# EasyEDA Pro project MAX5864_REUSE.eprj, board PCB1
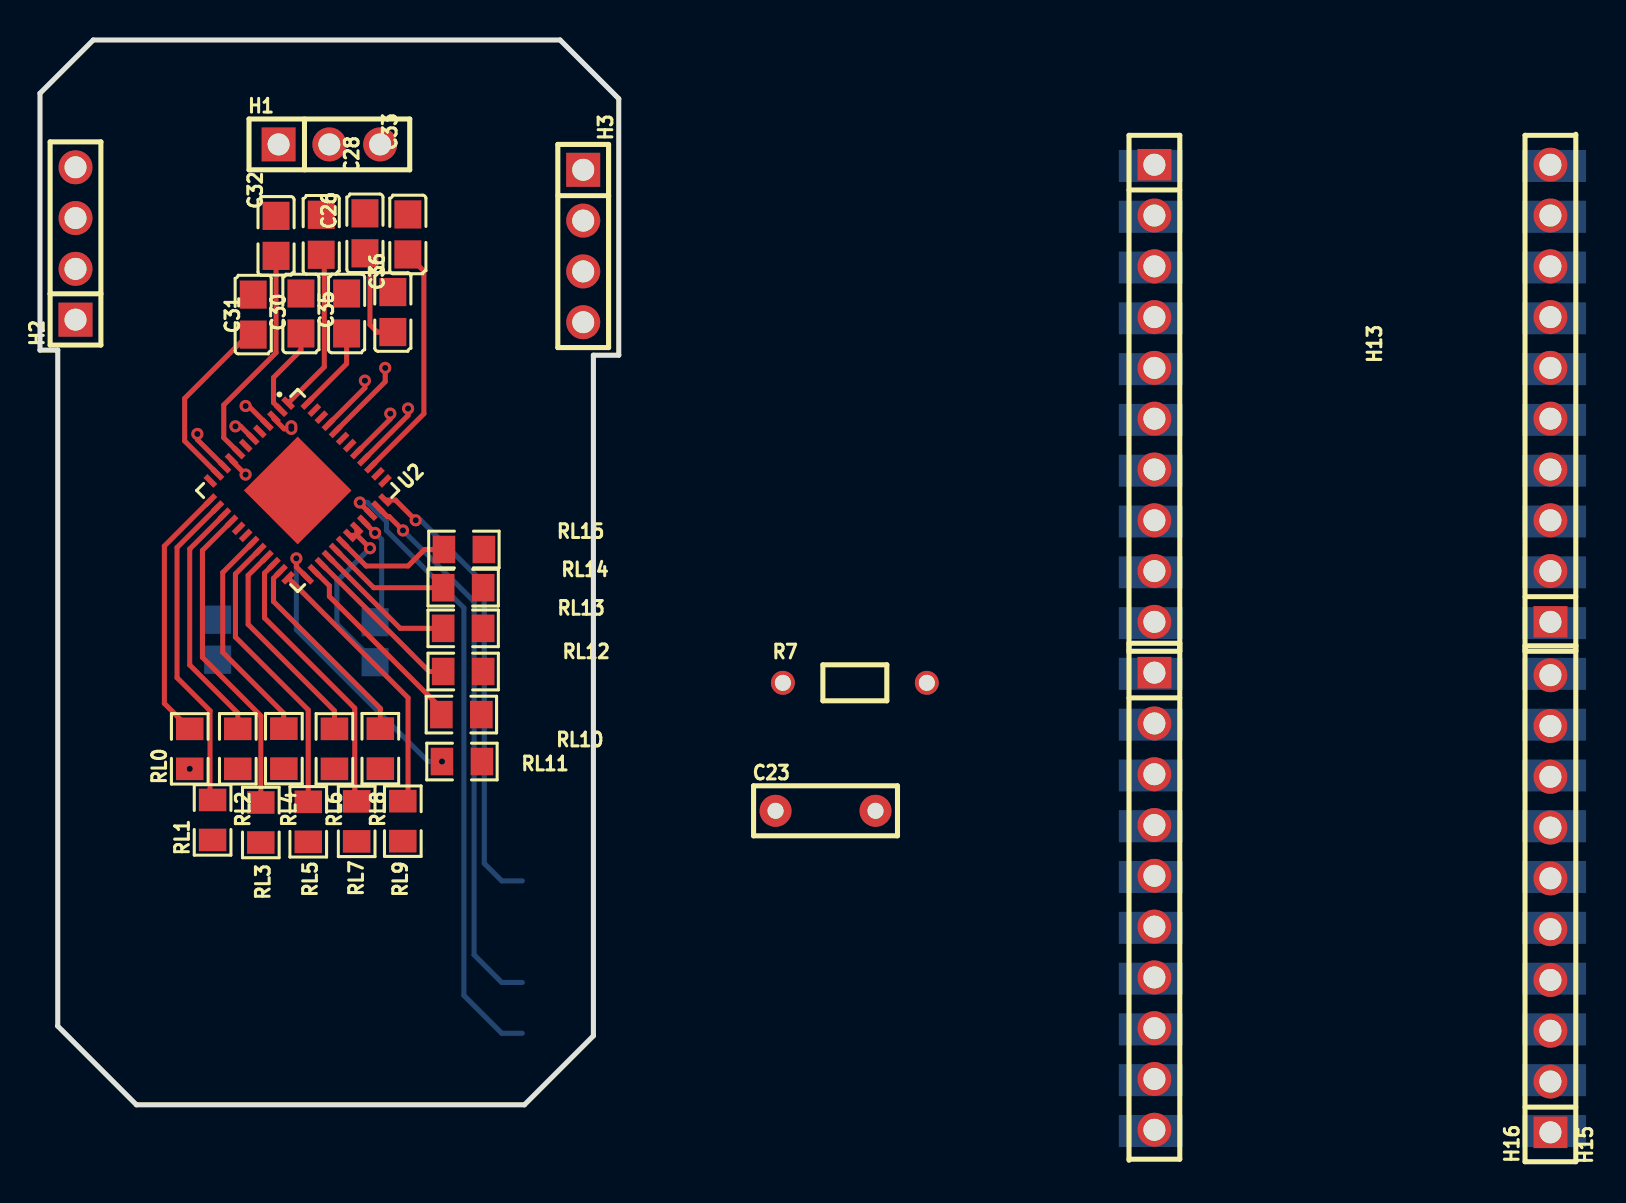
[diagram p4: board, top side]
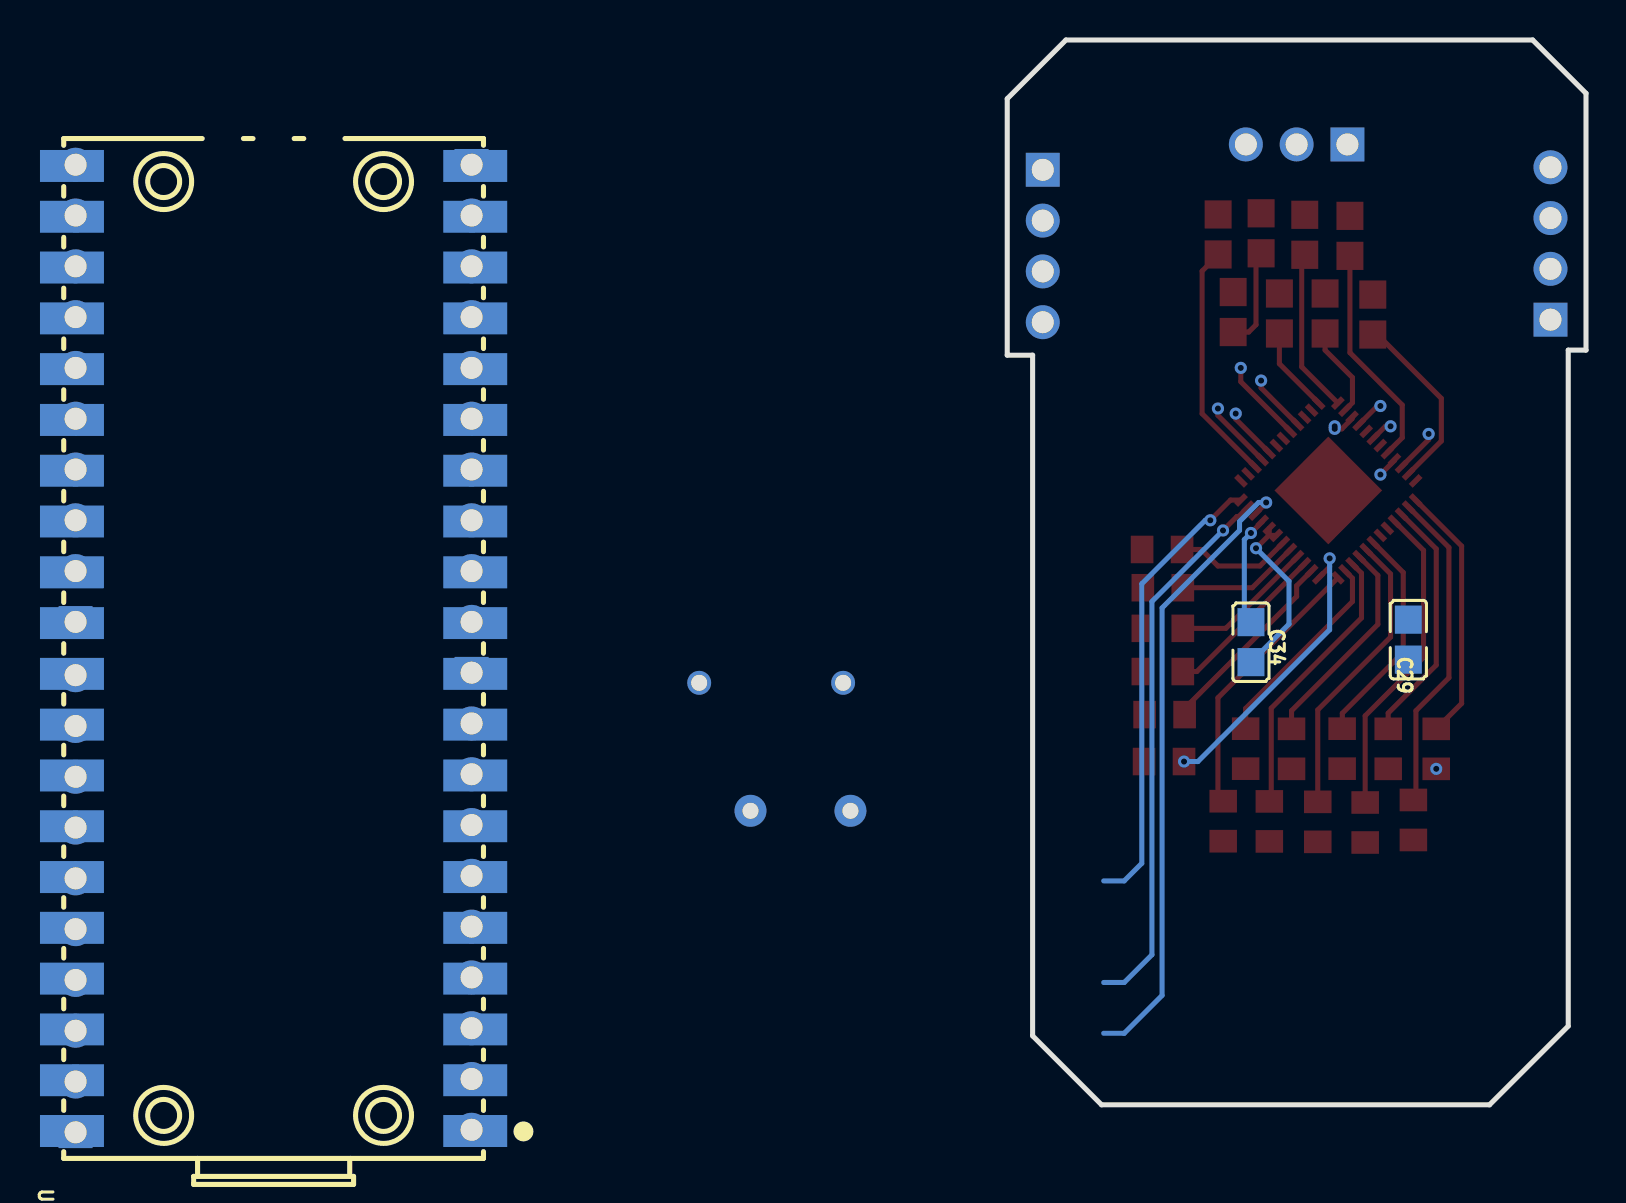
[diagram p5: board, bottom side, seen from below]

Outline 28.96 x 53.25 mm; copper layers: Top Layer, Inner1, Inner2, Inner3, Inner4, Bottom Layer. Coordinates in mm from the lower left corner of the outline.
Outline path: 0,50.58 0,37.74 0.89,37.74 0.89,3.94 4.83,0 24.24,0 27.69,3.45 27.69,37.49 28.96,37.49 28.96,50.31 26.02,53.25 2.67,53.25 0,50.58
Stack: Top Layer 0.035mm 外层铜厚1oz / Dielectric1 0.0994mm 3313 RC57% 4.2mil / Inner1 0.0152mm 内层铜厚 / Dielectric2 0.55mm 0.55mm H/H不含铜 / Inner2 0.0152mm 内层铜厚 / Dielectric3 0.1088mm 2116 RC54% 4.9mil / Inner3 0.0152mm 内层铜厚 / Dielectric4 0.55mm 0.55mm H/H不含铜 / Inner4 0.0152mm 内层铜厚 / Dielectric5 0.0994mm 3313 RC57% 4.2mil / Bottom Layer 0.035mm 外层铜厚1oz

## Design rules (mm)
template: JLCPCB Capability(Two Layers Board)
spacing copperThickness1oz (default): track to track 0.102, other pairs 0.152 to 0.3
spacing copperThickness2oz: track to track 0.203, other pairs 0.152 to 0.3
track width copperThickness1oz (default): min 0.127, default 0.254, max 2.54
track width copperThickness2oz: min 0.203, default 0.254, max 2.54
differential pair differentialPair (default): width min 0.127, default 0.254, max 2.54; gap min 0.152, default 0.152
via viaSize (default): diameter min 0.5, default 0.61, max 10; hole min 0.3, default 0.305, max 6.3

## Placement (name value [footprint] x y rotation side)
C23  470nF  [CAP-TH_L7.2-W2.5-P5.00-D0.5]  39.3 14.7 0 top
C26  100nF  [C0805]  14.07 43.51 270 top
C28  100nF  [C0805]  16.26 43.58 270 top
C29  100nF  [C0805]  8.89 23.26 90 bottom
C30  100nF  [C0805]  13.05 39.57 90 top
C31  100nF  [C0805]  10.67 39.52 270 top
C32  100nF  [C0805]  11.81 43.46 270 top
C33  100nF  [C0805]  18.4 43.53 90 top
C34  100nF  [C0805]  16.76 23.14 270 bottom
C35  100nF  [C0805]  15.34 39.57 90 top
C36  100nF  [C0805]  17.65 39.65 270 top
H1  -  [HDR-TH_3P-P2.54-V-M]  14.48 48.03 0 top
H2  -  [HDR-TH_4P-P2.54-V-M]  1.78 43.07 90 top
H3  -  [HDR-TH_4P-P2.54-V-M]  27.18 42.95 270 top
H13  -  [HDR-TH_10P-P2.54-V-F]  55.75 10.18 270 top
H14  -  [HDR-TH_10P-P2.54-V-F]  55.75 35.58 270 top
H15  -  [HDR-TH_10P-P2.54-V-F]  75.56 35.58 90 top
H16  -  [HDR-TH_10P-P2.54-V-F]  75.56 10.05 90 top
R7  10kΩ  [RES-TH_BD1.8-L3.2-P7.20-D0.4]  40.77 21.1 0 top
RL0  PFC-W0805LF-03-1301-B  [R0805]  7.49 17.8 90 top
RL1  PFC-W0805LF-03-1301-B  [R0805]  8.64 14.25 90 top
RL2  PFC-W0805LF-03-1301-B  [R0805]  9.9 17.8 90 top
RL3  PFC-W0805LF-03-1301-B  [R0805]  11.05 14.12 90 top
RL4  PFC-W0805LF-03-1301-B  [R0805]  12.2 17.81 90 top
RL5  PFC-W0805LF-03-1301-B  [R0805]  13.42 14.15 90 top
RL6  PFC-W0805LF-03-1301-B  [R0805]  14.73 17.8 90 top
RL7  PFC-W0805LF-03-1301-B  [R0805]  15.84 14.17 90 top
RL8  PFC-W0805LF-03-1301-B  [R0805]  17.03 17.81 90 top
RL9  PFC-W0805LF-03-1301-B  [R0805]  18.15 14.18 90 top
RL10  PFC-W0805LF-03-1301-B  [R0805]  21.11 17.17 180 top
RL11  PFC-W0805LF-03-1301-B  [R0805]  21.08 19.52 180 top
RL12  PFC-W0805LF-03-1301-B  [R0805]  21.17 21.67 180 top
RL13  PFC-W0805LF-03-1301-B  [R0805]  21.17 23.83 180 top
RL14  PFC-W0805LF-03-1301-B  [R0805]  21.17 25.86 180 top
RL15  PFC-W0805LF-03-1301-B  [R0805]  21.21 27.77 180 top
U2  MAX5864ETM+  [qfn-48_l7.0-w7.0-p0.50-bl-ep5.1]  12.89 30.72 225 top
U18  PICO  [COMM-SMD_L51.0-W21.0-P2.54_SC0916]  65.66 23.14 90 bottom

## Footprints (pads in the part's own frame, mm; a bottom-side part is the same pattern mirrored in y, then rotated)
C0805
  rect 1.41x1.35 smd: 1(-1,0) 2(1,0)
CAP-TH_L7.2-W2.5-P5.00-D0.5
  round 1.6 hole 0.8: 1(-2.5,0) 2(2.5,0)
COMM-SMD_L51.0-W21.0-P2.54_SC0916
  rect 1.6x3.2 smd: 1(-24.445,-10.088) 2(-21.905,-10.088) 3(-19.365,-10.088) 4(-16.825,-10.088) 5(-14.285,-10.088) 6(-11.745,-10.088) 7(-9.205,-10.088) 8(-6.665,-10.088) 9(-4.125,-10.088) 10(-1.585,-10.088) 11(0.955,-10.088) 12(3.495,-10.088) 13(6.035,-10.088) 14(8.575,-10.088) 15(11.115,-10.088) 16(13.655,-10.088) 17(16.195,-10.088) 18(18.735,-10.088) 19(21.275,-10.088) 20(23.815,-10.088) 21(23.815,10.088) 22(21.275,10.088) 23(18.735,10.088) 24(16.195,10.088) 25(13.655,10.088) 26(11.115,10.088) 27(8.575,10.088) 28(6.035,10.088) 29(3.495,10.088) 30(0.955,10.088) 31(-1.585,10.088) 32(-4.125,10.088) 33(-6.665,10.088) 34(-9.205,10.088) 35(-11.745,10.088) 36(-14.285,10.088) 37(-16.825,10.088) 38(-19.365,10.088) 39(-21.905,10.088) 40(-24.445,10.088)
HDR-TH_3P-P2.54-V-M
  rect 1.7x1.7 hole 1.1: 1(-2.54,0)
  round 1.7 hole 1.1: 2(0,0) 3(2.54,0)
HDR-TH_4P-P2.54-V-M
  rect 1.7x1.7 hole 1.1: 1(-3.81,0)
  round 1.7 hole 1.1: 2(-1.27,0) 3(1.27,0) 4(3.81,0)
HDR-TH_10P-P2.54-V-F
  rect 1.575x1.7 hole 1.1: 1(-11.43,0)
  round 1.7 hole 1.1: 2(-8.89,0) 3(-6.35,0) 4(-3.81,0) 5(-1.27,0) 6(1.27,0) 7(3.81,0) 8(6.35,0) 9(8.89,0) 10(11.43,0)
qfn-48_l7.0-w7.0-p0.50-bl-ep5.1
  rect 0.28x0.7 smd: 1(-2.75,-3.428) 2(-2.25,-3.428) 3(-1.75,-3.428) 4(-1.25,-3.428) 5(-0.75,-3.428) 6(-0.25,-3.428) 7(0.25,-3.428) 8(0.75,-3.428) 9(1.25,-3.428) 10(1.75,-3.428) 11(2.25,-3.428) 12(2.75,-3.428) 25(2.75,3.428) 26(2.25,3.428) 27(1.75,3.428) 28(1.25,3.428) 29(0.75,3.428) 30(0.25,3.428) 31(-0.25,3.428) 32(-0.75,3.428) 33(-1.25,3.428) 34(-1.75,3.428) 35(-2.25,3.428) 36(-2.75,3.428)
  rect 0.7x0.28 smd: 13(3.428,-2.75) 14(3.428,-2.25) 15(3.428,-1.75) 16(3.428,-1.25) 17(3.428,-0.75) 18(3.428,-0.25) 19(3.428,0.25) 20(3.428,0.75) 21(3.428,1.25) 22(3.428,1.75) 23(3.428,2.25) 24(3.428,2.75) 37(-3.428,2.75) 38(-3.428,2.25) 39(-3.428,1.75) 40(-3.428,1.25) 41(-3.428,0.75) 42(-3.428,0.25) 43(-3.428,-0.25) 44(-3.428,-0.75) 45(-3.428,-1.25) 46(-3.428,-1.75) 47(-3.428,-2.25) 48(-3.428,-2.75)
  rect 3.81x3.81 smd: 49(0,0)
R0805
  rect 1.133x1.377 smd: 1(-1,0) 2(1,0)
RES-TH_BD1.8-L3.2-P7.20-D0.4
  round 1.2 hole 0.8: 1(-3.6,0) 2(3.6,0)

## Nets
As in the schematic, except:
GND: C23.1 C26.1 C28.1 C29.1 C30.2 C31.1 C32.1 C33.2 C35.2 C36.1 H13.3 H13.8 H14.3 H14.8 H15.3 H15.8 H16.3 H16.6 H16.8 U2.5 U2.7 U2.12 U2.17 U2.37 U2.42 U2.47 U18.3 U18.8 U18.13 U18.18 U18.23 U18.28 U18.33 U18.35 U18.38
$1N1844: C34.2 U2.31 U2.32

Pads without a net: U2 38 49

## Via types
v1: diameter 0.61, hole 0.305, Top Layer to Bottom Layer, 18 vias

## Routing (per net, layer and track width the routed paths; a pad name or vN(x,y) marks a point on that pad's centre or on a via; arc(x,y) is an arc through that point)
3.3V: length 5.6
  Top Layer w0.254: U2.33 16.2,29.16 v1(16.76,28.6)
  Bottom Layer w0.254: C34.1 17.09,24.47 17.09,28.27 v1(16.76,28.6)
B0:
  vias: v1(7.49,16.8)
BBC_CLK: length 1.1
  Top Layer w0.254: v1(9.78,33.93) 10.04,33.93 U2.6
BBC_CS: length 22.9
  Top Layer w0.254: U2.36 17.78,30.24 v1(18.8,29.23)
  Bottom Layer w0.254: 24.13,11.2 23.1,11.2 22.22,12.08 22.22,26.06 19.05,29.23 v1(18.8,29.23)
BBC_DA0: length 12.9
  Top Layer w0.254: U2.13 6.22,27.94 6.22,20.07 RL0.2
BBC_DA1: length 16.2
  Top Layer w0.254: U2.14 6.86,27.87 6.86,21.36 8.51,19.71 8.51,15.37 RL1.2
BBC_DA2: length 12.4
  Top Layer w0.254: U2.15 7.49,27.8 7.49,21.99 9.9,19.59 RL2.2
BBC_DA3: length 15.9
  Top Layer w0.254: U2.16 8.13,27.73 8.13,22.37 11.05,19.45 RL3.2
BBC_DA4: length 11.2
  Top Layer w0.254: U2.19 9.14,26.62 9.14,22.63 12.19,19.58 12.19,18.82 RL4.2
BBC_DA5: length 14.6
  Top Layer w0.254: U2.20 9.78,26.55 9.78,23.39 13.42,19.75 RL5.2
BBC_DA6: length 10.8
  Top Layer w0.254: U2.21 10.41,26.48 10.41,24.02 14.73,19.71 RL6.2
BBC_DA7: length 14
  Top Layer w0.254: RL7.2 15.75,15.27 15.75,19.83 11.23,24.35 11.23,26.59 11.71,27.06
BBC_DD0: length 10.3
  Top Layer w0.254: U2.23 11.68,26.33 11.68,25.17 17.03,19.82 RL8.2
BBC_DD1: length 13.8
  Top Layer w0.254: RL9.2 18.41,15.45 18.41,20.35 U2.24
BBC_DD2: length 14.8
  Top Layer w0.254: U2.25 12.83,26.9 v1(12.83,27.33)
  Bottom Layer w0.254: v1(12.83,27.33) 12.83,23.76 19.42,17.17 v1(20.11,17.17)
BBC_DD3: length 9.8
  Top Layer w0.254: U2.26 14.48,25.95 14.48,25.42 20.08,19.82 RL11.2
BBC_DD4: length 8.3
  Top Layer w0.254: 14.08,27.06 19.47,21.67 RL12.2
BBC_DD5: length 7.2
  Top Layer w0.254: RL13.2 18.02,23.83 U2.28
BBC_DD6: length 6.2
  Top Layer w0.254: U2.29 16.69,25.86 RL14.2
BBC_DD7: length 5.9
  Top Layer w0.254: U2.30 16.32,26.95 18.41,26.95 19.24,27.77 RL15.2
BBC_DIN: length 31.5
  Top Layer w0.254: v1(16,30.12) 16,30.09 U2.34
  Bottom Layer w0.254: v1(16,30.12) 16.38,30.12 17.33,29.17 17.33,28.72 21.21,24.85 21.21,5.47 23.1,3.58 24.13,3.58
BBC_IN: length 17.8
  Top Layer w0.254: U2.44 17.27,36.16 v1(17.27,36.85)
  Inner3 w0.254: 27.18,44.22 25.91,42.95 22.22,42.95 17.27,37.99 v1(17.27,36.85)
BBC_IP: length 19.9
  Top Layer w0.254: v1(16.26,36.22) 16.26,35.85 U2.45
  Inner3 w0.254: v1(16.26,36.22) 16.26,39.14 22.61,45.49 25.91,45.49 H3.1
BBC_QN: length 14
  Top Layer w0.254: v1(18.41,34.82) 18.41,34.48 U2.40
  Inner3 w0.254: H3.4 25.91,37.87 22.99,37.87 19.94,34.82 v1(18.41,34.82)
BBC_QP: length 15.9
  Top Layer w0.254: v1(17.53,34.57) 17.53,34.3 15.85,32.62
  Inner3 w0.254: H3.3 27.18,41.42 26.16,40.41 22.48,40.41 17.53,35.45 v1(17.53,34.57)
BBC_SCLK: length 27.4
  Top Layer w0.254: v1(18.16,28.72) 17.47,29.42 17.38,29.42 U2.35
  Bottom Layer w0.254: 24.13,6.12 23.1,6.12 21.72,7.5 21.72,25.17 v1(18.16,28.72)
RX_BBCIN: length 1.4
  Top Layer w0.254: U2.4 10.44,34.95 v1(10.29,34.95)
RX_BBCIP: length 1.3
  Top Layer w0.254: v1(12.57,33.8) 12.21,33.8 11.71,34.31 11.71,34.38
  Bottom Layer w0.254: v1(12.57,33.8) v1(12.57,33.93)
RX_BBCQN: length 1
  Top Layer w0.254: v1(10.29,31.52) 9.59,32.22 U2.9
RX_BBCQP: length 12.5
  Top Layer w0.254: v1(7.87,33.55) 7.87,33.27 U2.10
  Inner3 w0.254: H2.1 2.29,39.26 3.56,37.99 6.6,37.99 7.87,36.72 v1(7.87,33.55)
$1N1830: length 4.6
  Top Layer w0.254: U2.2 11.68,35.11 11.68,36.37 13.05,37.74 C30.1
$1N1844: length 8.8
  Top Layer w0.254: 15.87,28.48 15.49,28.48 ; 15.87,28.48 15.85,28.5 15.85,28.83 ; 15.87,28.48 v1(16.51,27.83)
  Bottom Layer w0.254: C34.2 14.86,24.04 14.86,26.18 v1(16.51,27.83)
$1N3073: length 8.2
  Top Layer w0.254: C26.2 14.22,42.36 14.22,36.9 U2.1
$1N3079: length 4.3
  Top Layer w0.254: C35.1 15.34,37.06 U2.48
$1N3266: length 5
  Top Layer w0.254: C28.2 16.51,42.33 16.51,39.01 16.88,38.65 C36.2
$1N3998: length 9.2
  Top Layer w0.254: C31.2 10.43,38.52 7.24,35.33 7.24,33.19 U2.11
$1N4024: length 11.2
  Top Layer w0.254: U2.8 9.19,33.36 9.19,35 11.81,37.61 C32.2
$1N4050: length 12
  Top Layer w0.254: C33.1 18.4,42.5 19.21,41.69 19.21,34.56 U2.39
